# Altium project Multibattery Charger.PrjPcb
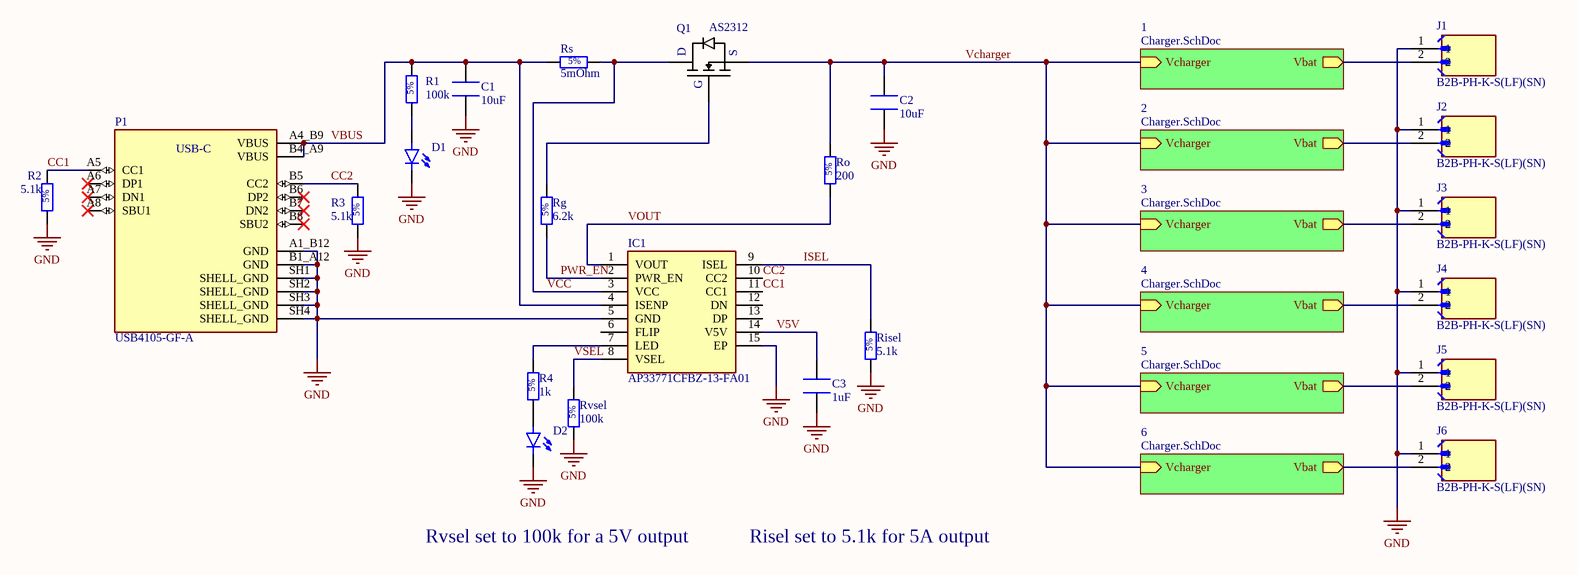
[diagram p0: Main.SchDoc]
2 sheets, 65 parts. Net scope: hierarchical (ports join the sheet entries above them; power ports are global).
Board file: MBC PCB.PcbDoc
Sheets:
  Main.SchDoc
    2 = Charger.SchDoc
    3 = Charger.SchDoc
    4 = Charger.SchDoc
    5 = Charger.SchDoc
    6 = Charger.SchDoc
    1 = Charger.SchDoc

## Sheet Main.SchDoc
size A3; SheetNumber: 1; SheetTotal: 2

### Parts
C1  10uF  [CAPACITOR_0805_2012M-70N]
C2  10uF  [CAPACITOR_0805_2012M-70N]
C3  1uF  [CAPACITOR_0805_2012M-70N]
D1  LTST-C190 Series  [LED_0603_1608M_0.80mm]  (value not drawn)
D2  LTST-C190 Series  [LED_0603_1608M_0.80mm]  (value not drawn)
IC1  AP33771CFBZ-13-FA01  [AP33771CFBZ13FA01]
J1  B2B-PH-K-S(LF)(SN)  [JST_B2B-PH-K-S(LF)(SN)]
J2  B2B-PH-K-S(LF)(SN)  [JST_B2B-PH-K-S(LF)(SN)]
J3  B2B-PH-K-S(LF)(SN)  [JST_B2B-PH-K-S(LF)(SN)]
J4  B2B-PH-K-S(LF)(SN)  [JST_B2B-PH-K-S(LF)(SN)]
J5  B2B-PH-K-S(LF)(SN)  [JST_B2B-PH-K-S(LF)(SN)]
J6  B2B-PH-K-S(LF)(SN)  [JST_B2B-PH-K-S(LF)(SN)]
P1  USB4105-GF-A  [GCT_USB4105-GF-A]
Q1  AS2312  [SOT23-3N-1.15mm]
R1  100k  [Resistor_0805_2012M-50N]
R2  5.1k  [Resistor_0805_2012M-50N]
R3  5.1k  [Resistor_0805_2012M-50N]
R4  1k  [Resistor_0805_2012M-50N]
Rg  6.2k  [Resistor_0805_2012M-50N]
Risel  5.1k  [Resistor_0805_2012M-50N]
Ro  200  [Resistor_0805_2012M-50N]
Rs  5mOhm  [Resistor_0805_2012M-50N]
Rvsel  100k  [Resistor_0805_2012M-50N]

### Sub-sheets
1 = Charger.SchDoc: Vcharger (in), Vbat (out)
2 = Charger.SchDoc: Vcharger (in), Vbat (out)
3 = Charger.SchDoc: Vcharger (in), Vbat (out)
4 = Charger.SchDoc: Vcharger (in), Vbat (out)
5 = Charger.SchDoc: Vcharger (in), Vbat (out)
6 = Charger.SchDoc: Vcharger (in), Vbat (out)

### Nets
GND: C1.1 C2.1 C3.1 D1.C D2.C IC1.5(GND) IC1.15(EP) J1.1 J2.1 J3.1 J4.1 J5.1 J6.1 P1.A1_B12(GND) P1.B1_A12(GND) P1.SH1(SHELL_GND) P1.SH2(SHELL_GND) P1.SH3(SHELL_GND) P1.SH4(SHELL_GND) R2.1 R3.1 Risel.1 Rvsel.1
CC1: IC1.11(CC1) P1.A5(CC1) R2.2
CC2: IC1.10(CC2) P1.B5(CC2) R3.2
ISEL: IC1.9(ISEL) Risel.2
PWR_EN: IC1.2(PWR_EN) Rg.1
V5V: C3.2 IC1.14(V5V)
Vbat: J1.2 ; sheet 1/Vbat
Vbat: J2.2 ; sheet 2/Vbat  [a separate net that carries the same name]
Vbat: J3.2 ; sheet 3/Vbat  [a separate net that carries the same name]
Vbat: J4.2 ; sheet 4/Vbat  [a separate net that carries the same name]
Vbat: J5.2 ; sheet 5/Vbat  [a separate net that carries the same name]
Vbat: J6.2 ; sheet 6/Vbat  [a separate net that carries the same name]
VBUS: C1.2 IC1.4(ISENP) P1.A4_B9(VBUS) P1.B4_A9(VBUS) R1.2 Rs.1
VCC: IC1.3(VCC) Q1.3(D) Rs.2
Vcharger: C2.2 Q1.2(S) Ro.2 ; sheet 2/Vcharger, sheet 3/Vcharger, sheet 4/Vcharger, sheet 5/Vcharger, sheet 6/Vcharger, sheet 1/Vcharger
VOUT: IC1.1(VOUT) Ro.1
VSEL: IC1.8(VSEL) Rvsel.2
NetD1_A: D1.A R1.1
NetD2_A: D2.A R4.1
NetIC1_7: IC1.7(LED) R4.2
NetQ1_1: Q1.1(G) Rg.2

Not connected (* = marked no-connect by the designer): IC1 6(FLIP) 12(DN) 13(DP); P1 A6(DP1)* A7(DN1)* A8(SBU1)* B6(DP2)* B7(DN2)* B8(SBU2)*

### Notes on the sheet
- (near P1) USB-C
- Rvsel set to 100k for a 5V output
- Risel set to 5.1k for 5A output

### Library data of the parts
C1-C3 = GRM21BR60J107ME15L: Passive - Capacitor, 0805, 100uF Max, X5R, 6.3V ±20%, -55°C ~ 85°C, 0805 (2012 Metric). 20uF @ 6.3V; APSS Standard Part: APSS Standard; Tolerance: ±20%; Temperature Coefficient: X5R; Capacitance at Rated Voltage: 20%; Rated Voltage: 6.3V; Temp Range: -55°C ~ 85°C; Package: 0805; Supplier 1: Digikey; Supplier 1 Part No.: 490-GRM155R61E225KE11JCT-ND; MF Part No.: GRM21BR60J107ME15L
  C1 C2: Value: 10uF
  C3: Value: 1uF
D1 D2 = LTST-C190 Series: Diode - LED, 0603; APSS Standard Part: APSS Standard; Temp Range: -30°C ~ 85°C; Rated Voltage: 5V Reverse; Package: 0603; Supplier 1: Digikey; MF Part No.: *; Colour: *
IC1 = AP33771CFBZ-13-FA01: Integrated Circuit; Manufacturer_Name: Diodes Incorporated; Datasheet Link: https://www.diodes.com/datasheet/download/AP33771C.pdf; Height: 0.8mm; Manufacturer_Part_Number: AP33771CFBZ-13-FA01; Mouser Part Number: 621-P33771CFBZ13FA01; Mouser Price/Stock: https://www.mouser.co.uk/ProductDetail/Diodes-Incorporated/AP33771CFBZ-13-FA01?qs=2wMNvWM5ZX7JpCFGcPz6nw%3D%3D; Arrow Part Number: AP33771CFBZ-13-FA01; Arrow Price/Stock: https://www.arrow.com/en/products/ap33771cfbz-13-fa01/diodes-incorporated?utm_currency=USD&region=nac
J1-J6 = B2B-PH-K-S(LF)(SN): Connector Header Through Hole 2 position 0.079 (2.00mm); MF: JST; SnapEDA_Link: https://www.snapeda.com/parts/B2B-PH-K-S%20(LF)(SN)/JST/view-part/?ref=snap; Package: None; Value: *; MP: B2B-PH-K-S (LF)(SN); Check_prices: https://www.snapeda.com/parts/B2B-PH-K-S%20(LF)(SN)/JST/view-part/?ref=eda
P1 = USB4105-GF-A: USB-C (USB TYPE-C) USB 2.0 Receptacle Connector 24 (16+8 Dummy) Position Surface Mount, Right Angle; Through Hole; MF Part No.: USB4105-GF-A; Supplier 1 Part No.: 2073-USB4105-GF-ACT-ND; Supplier 1: Digikey
Q1 = AS2312: Transistor - MOSFET, N-Channel AS2312; APSS Standard Part: APSS Standard; Temp Range: 0°C ~ 150°C (TJ); Rated Voltage: 20 Vds; Power: 1.2W; MF Part No.: AS2312; Package: SOT-23-3; Supplier 1: Digikey; Supplier 1 Part No.: 4530-AS2312CT-ND
R1-R4 Rg Risel Ro Rs Rvsel = RMCF0805JT Series: Passive - Resistor Series, 0805, 5%, 100m - 22M, E24, 0.063W, 1/16W, ±200ppm/°C, -55°C ~ 155°C, 0805 (2012 Metric); APSS Standard Part: APSS Standard; Power: 1/8W; Value Range: 100m ~ 22M; Rated Voltage: 150V; Tolerance: 5%; E Series: E24; Temp Range: -55°C ~ 155°C; Supplier 1: Digikey; Package: 0805; Temperature Coefficient: ±200ppm/°C; MF Part No.: *
  R1 Rvsel: Value: 100k
  R2 R3 Risel: Value: 5.1k
  R4: Value: 1k
  Rg: Value: 6.2k
  Ro: Value: 200
  Rs: Value: 5mOhm

## Sheet Charger.SchDoc
size A3; SheetNumber: 2; SheetTotal: 2
Used 6 times, as channels 2, 3, 4, 5, 6, 1. Parts and nets are listed once, with the designators drawn on the sheet.
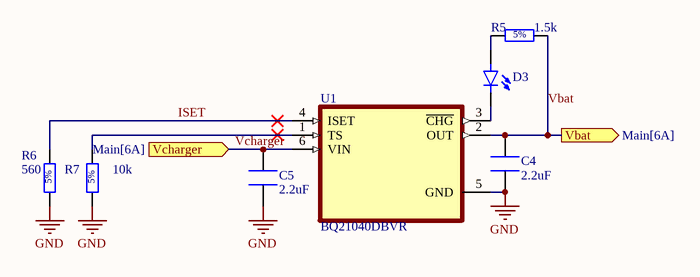
[diagram p1: Charger.SchDoc]

### Parts
C4  2.2uF  [CAPACITOR_0805_2012M-70N]
C5  2.2uF  [CAPACITOR_0805_2012M-70N]
D3  LTST-C190 Series  [LED_0603_1608M_0.80mm]  (value not drawn)
R5  1.5k  [Resistor_0805_2012M-50N]
R6  560  [Resistor_0805_2012M-50N]
R7  10k  [Resistor_0805_2012M-50N]
U1  BQ21040DBVR  [SOT95P280X145-6N]

### Ports
Vbat (out, see Main[6A]), Vcharger (in, see Main[6A])

### Nets
GND: C4.1 C5.1 R6.1 R7.1 U1.5(GND)
ISET: R6.2 U1.4(ISET)
Vbat: C4.2 R5.2 U1.2(OUT) ; port Vbat
Vcharger: C5.2 U1.6(VIN) ; port Vcharger
NetD3_A: D3.A R5.1
NetD3_C: D3.C U1.3(~{CHG})
NetR7_2: R7.2 U1.1(TS)

### Channels
2: designators end in _2; ports Vbat=Vbat Vcharger=Vcharger
3: designators end in _3; ports Vbat=Vbat Vcharger=Vcharger
4: designators end in _4; ports Vbat=Vbat Vcharger=Vcharger
5: designators end in _5; ports Vbat=Vbat Vcharger=Vcharger
6: designators end in _6; ports Vbat=Vbat Vcharger=Vcharger
1: designators end in _1; ports Vbat=Vbat Vcharger=Vcharger

### Library data of the parts
C4 C5 = C0805C225K8PACTU: Passive - Capacitor, X5R, 2.2uF Max, 10V, 0805 (2012 Metric), ±10%, -55°C ~ 85°C. 2uF @ 5V, 1.1uF @ 10V; APSS Standard Part: APSS Standard; Capacitance at Rated Voltage: 50%; Tolerance: ±10%; Temperature Coefficient: X5R; Rated Voltage: 10V; Temp Range: -55°C ~ 85°C; Package: 0805; Supplier 1: Digikey; Supplier 1 Part No.: 399-C0805C225K8PACTUCT-ND; MF Part No.: C0805C225K8PACTU; Value: 2.2uF
D3 = LTST-C190 Series: as D1 on sheet Main; Package: 0603; Supplier 1: Digikey; MF Part No.: *; Colour: *
R5-R7 = RMCF0805JT Series: as R1 on sheet Main; Tolerance: 5%; E Series: E24; Temp Range: -55°C ~ 155°C; Supplier 1: Digikey; Package: 0805; Temperature Coefficient: ±200ppm/°C; MF Part No.: *
  R5: Value: 1.5k
  R6: Value: 560
  R7: Value: 10k
U1 = BQ21040DBVR: 1-cell, 0.8-A Li-ion and Li-polymer battery charger; MF: Texas Instruments; Package: SOT23-6; MF Part No.: BQ21040DBVR; Value: *; Supplier 1 Part No.: 296-47315-1-ND; Supplier 1: Digikey

## Nets that join several sheets
GND: Main (23 pins), 2 (5 pins), 3 (5 pins), 4 (5 pins), 5 (5 pins), 6 (5 pins), 1 (5 pins)
Vbat: Main (J1.2), 1 (C4_1.2 R5_1.2 U1_1.2)
Vbat: Main (J2.2), 2 (C4_2.2 R5_2.2 U1_2.2)
Vbat: Main (J3.2), 3 (C4_3.2 R5_3.2 U1_3.2)
Vbat: Main (J4.2), 4 (C4_4.2 R5_4.2 U1_4.2)
Vbat: Main (J5.2), 5 (C4_5.2 R5_5.2 U1_5.2)
Vbat: Main (J6.2), 6 (C4_6.2 R5_6.2 U1_6.2)
Vcharger: Main (C2.2 Q1.2 Ro.2), 2 (C5_2.2 U1_2.6), 3 (C5_3.2 U1_3.6), 4 (C5_4.2 U1_4.6), 5 (C5_5.2 U1_5.6), 6 (C5_6.2 U1_6.6), 1 (C5_1.2 U1_1.6)